# EAGLE schematic PhotoBoothRaspPi (EAGLE 6.2)
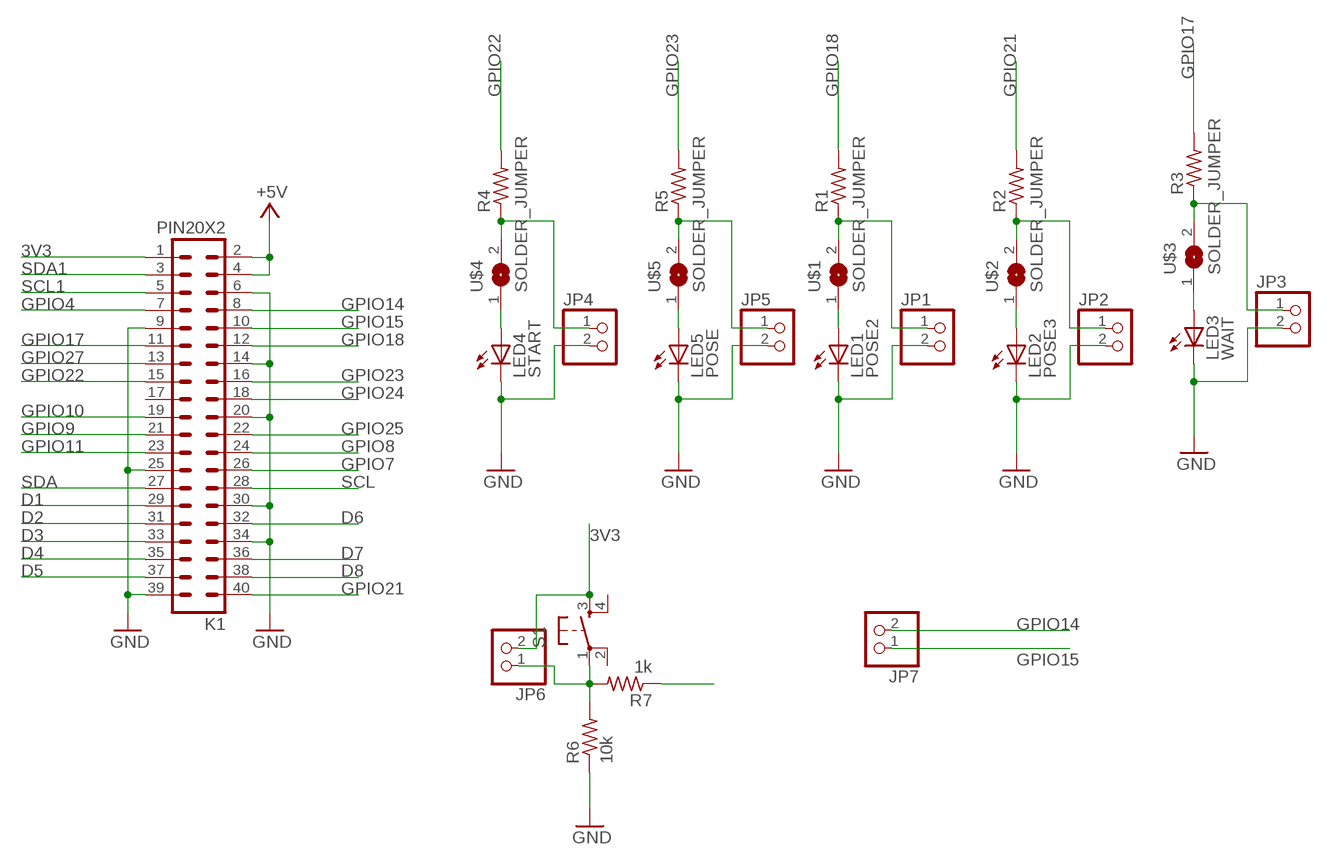
[diagram p0: schematic, sheet 1]

## Parts
JP1  PINHD-1X2  [1X02]
JP2  PINHD-1X2  [1X02]
JP3  PINHD-1X2  [1X02]
JP4  PINHD-1X2  [1X02]
JP5  PINHD-1X2  [1X02]
JP6  PINHD-1X2  [1X02]
JP7  PINHD-1X2  [1X02]
K1  PIN20X2  [PIN_20X2]
LED1  POSE2  LEDCHIPLED_1206  [CHIPLED_1206]
LED2  POSE3  LEDCHIPLED_1206  [CHIPLED_1206]
LED3  WAIT  LEDCHIPLED_1206  [CHIPLED_1206]
LED4  START  LEDCHIPLED_1206  [CHIPLED_1206]
LED5  POSE  LEDCHIPLED_1206  [CHIPLED_1206]
R1  RES-US1206FAB  [R1206FAB]
R2  RES-US1206FAB  [R1206FAB]
R3  RES-US1206FAB  [R1206FAB]
R4  RES-US1206FAB  [R1206FAB]
R5  RES-US1206FAB  [R1206FAB]
R6  10k  RES-US1206FAB  [R1206FAB]
R7  1k  RES-US1206FAB  [R1206FAB]
S1  6MM_SWITCH6MM_SWITCH  [6MM_SWITCH]
U$1  SOLDER_JUMPER  [SJFAB]
U$2  SOLDER_JUMPER  [SJFAB]
U$3  SOLDER_JUMPER  [SJFAB]
U$4  SOLDER_JUMPER  [SJFAB]
U$5  SOLDER_JUMPER  [SJFAB]

## Nets
3V3: JP6.2 K1.1 S1.3(S)
+5V: K1.2 K1.4
D1: K1.29
D2: K1.31
D3: K1.33
D4: K1.35
D5: K1.37
D6: K1.32
D7: K1.36
D8: K1.38
GND: JP1.2 JP2.2 JP3.2 JP4.2 JP5.2 K1.6 K1.9 K1.14 K1.20 K1.25 K1.30 K1.34 K1.39 LED1.C LED2.C LED3.C LED4.C LED5.C R6.1
GPIO4: K1.7
GPIO7: K1.26
GPIO8: K1.24
GPIO9: K1.21
GPIO10: K1.19
GPIO11: K1.23
GPIO14: JP7.2 K1.8
GPIO15: JP7.1 K1.10
GPIO17: K1.11 R3.2
GPIO18: K1.12 R1.2
GPIO21: K1.40 R2.2
GPIO22: K1.15 R4.2
GPIO23: K1.16 R5.2
GPIO24: K1.18 R7.1
GPIO25: K1.22
GPIO27: K1.13
N$1: JP1.1 R1.1 U$1.2
N$2: LED1.A U$1.1
N$3: JP2.1 R2.1 U$2.2
N$4: LED2.A U$2.1
N$5: JP3.1 R3.1 U$3.2
N$6: LED3.A U$3.1
N$7: JP4.1 R4.1 U$4.2
N$8: LED4.A U$4.1
N$9: JP5.1 R5.1 U$5.2
N$10: LED5.A U$5.1
N$12: JP6.1 R6.2 R7.2 S1.1(P)
SCL: K1.28
SCL1: K1.5
SDA: K1.27
SDA1: K1.3
Unconnected: K1.17 S1.2(P1) S1.4(S1)

## Library data of the parts
JP1-JP7 = pinhead:PINHD-1X2: PIN HEADER
K1 = FLYFISH:PIN20X2
LED1-LED5 = led:LED: LED OSRAM: - CHIPLED LG R971, LG N971, LY N971, LG Q971, LY Q971, LO R971, LY R971 LH N974, LH R974 LS Q976, LO Q976, LY Q976 LO Q996 - Hyper CHIPLED LW Q18S LB Q993, LB Q99A, LB R99A - SideLED LS A670, LO A670, LY A670, LG A670, LP A670 LB A673, LV A673, LT A673, LW A673 LH A674 LY A675 LS A676, LA A676, LO A676, LY A676, LW A676 LS A679, LY A679, LG A679 - Hyper Micro SIDELED® LS Y876, LA Y876, LO Y876, LY Y876 LT Y87S - SmartLED LW L88C, LW L88S LB L89C, LB L89S, LG L890 LS L89K, LO L89K, LY L89K LS L896, LA L896, LO L896, LY L896 - TOPLED LS T670, LO T670, LY T670, LG T670, LP T670 LSG T670, LSP T670, LSY T670, LOP T670, LYG T670 LG T671, LOG T671, LSG T671 LB T673, LV T673, LT T673, LW T673 LH T674 LS T676, LA T676, LO T676, LY T676, LB T676, LH T676, LSB T676, LW T676 LB T67C, LV T67C, LT T67C, LS T67K, LO T67K, LY T67K, LW E67C LS E67B, LA E67B, LO E67B, LY E67B, LB E67C, LV E67C, LT E67C LW T67C LS T679, LY T679, LG T679 LS T770, LO T770, LY T770, LG T770, LP T770 LB T773, LV T773, LT T773, LW T773 LH T774 LS E675, LA E675, LY E675, LS T675 LS T776, LA T776, LO T776, LY T776, LB T776 LHGB T686 LT T68C, LB T68C - Hyper Mini TOPLED® LB M676 - Mini TOPLED Santana® LG M470 LS M47K, LO M47K, LY M47K Source: http://www.osram.convergy.de LUXEON: - LUMILED® LXK2-PW12-R00, LXK2-PW12-S00, LXK2-PW14-U00, LXK2-PW14-V00 LXK2-PM12-R00, LXK2-PM12-S00, LXK2-PM14-U00 LXK2-PE12-Q00, LXK2-PE12-R00, LXK2-PE12-S00, LXK2-PE14-T00, LXK2-PE14-U00 LXK2-PB12-K00, LXK2-PB12-L00, LXK2-PB12-M00, LXK2-PB14-N00, LXK2-PB14-P00, LXK2-PB14-Q00 LXK2-PR12-L00, LXK2-PR12-M00, LXK2-PR14-Q00, LXK2-PR14-R00 LXK2-PD12-Q00, LXK2-PD12-R00, LXK2-PD12-S00 LXK2-PH12-R00, LXK2-PH12-S00 LXK2-PL12-P00, LXK2-PL12-Q00, LXK2-PL12-R00 Source: www.luxeon.com KINGBRIGHT: KA-3528ASYC Source: www.kingbright.com
R1-R7 = fab2:RES-US: Resistor (US Symbol) Variants with postfix FAB are widened to allow the routing of internal traces
S1 = fab2:6MM_SWITCH: OMRON SWITCH
U$1-U$5 = fab2:SOLDER_JUMPER